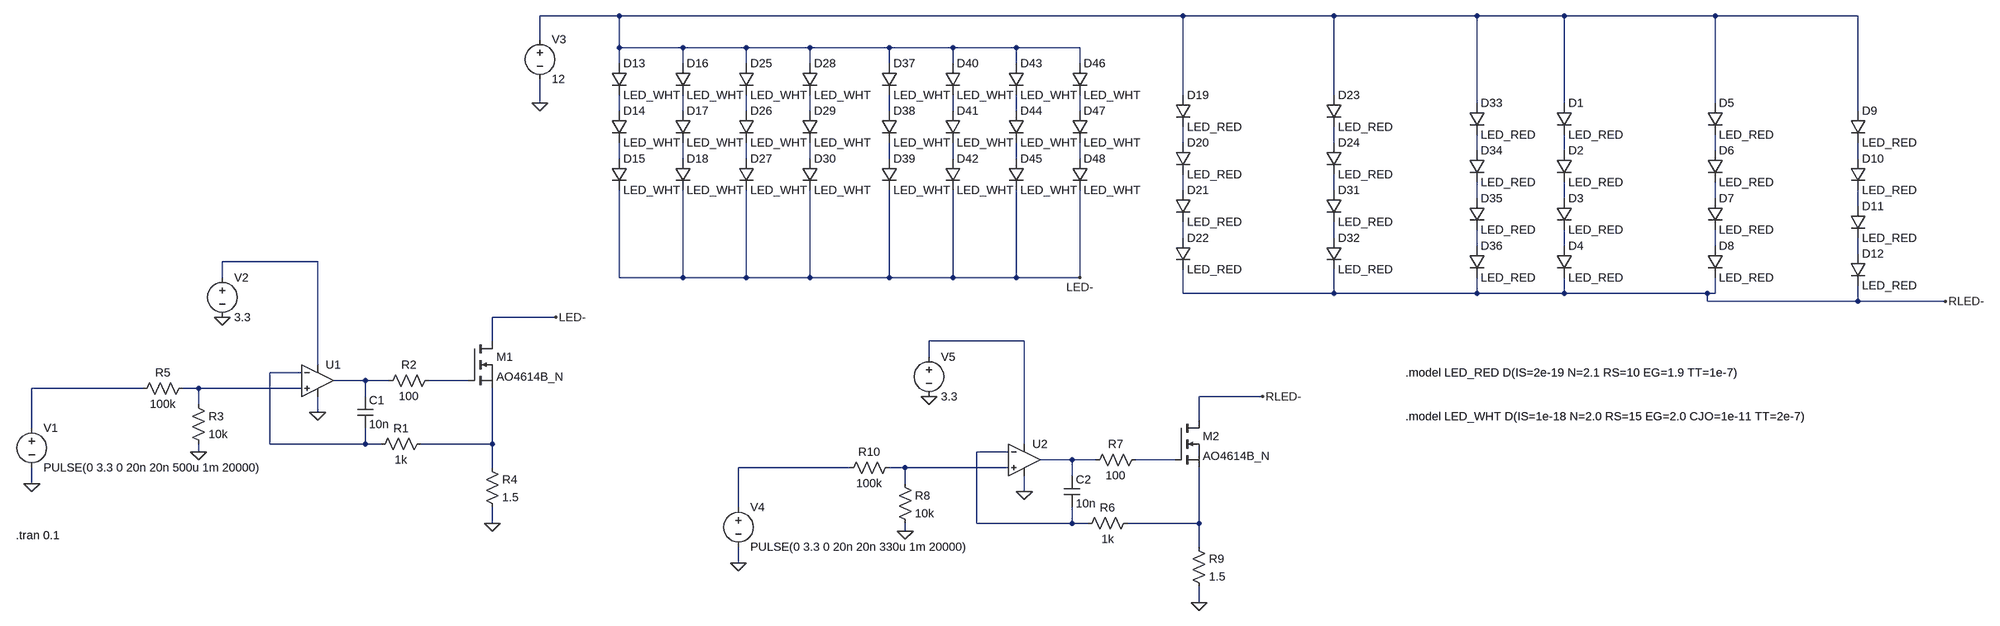
[diagram p0: schematic LED Driver Circuit.asc]
LED Driver Circuit.asc, the LTspice schematic file:
Version 4
SHEET 1 3560 976
WIRE 800 -576 640 -576
WIRE 1936 -576 800 -576
WIRE 2240 -576 1936 -576
WIRE 2528 -576 2240 -576
WIRE 2704 -576 2528 -576
WIRE 3008 -576 2704 -576
WIRE 3296 -576 3008 -576
WIRE 640 -528 640 -576
WIRE 800 -512 800 -576
WIRE 928 -512 800 -512
WIRE 1056 -512 928 -512
WIRE 1184 -512 1056 -512
WIRE 1344 -512 1184 -512
WIRE 1472 -512 1344 -512
WIRE 1600 -512 1472 -512
WIRE 1728 -512 1600 -512
WIRE 800 -480 800 -512
WIRE 928 -480 928 -512
WIRE 1056 -480 1056 -512
WIRE 1184 -480 1184 -512
WIRE 1344 -480 1344 -512
WIRE 1472 -480 1472 -512
WIRE 1600 -480 1600 -512
WIRE 1728 -480 1728 -512
WIRE 1936 -416 1936 -576
WIRE 2240 -416 2240 -576
WIRE 640 -400 640 -448
WIRE 2528 -400 2528 -576
WIRE 2704 -400 2704 -576
WIRE 3008 -400 3008 -576
WIRE 800 -384 800 -416
WIRE 928 -384 928 -416
WIRE 1056 -384 1056 -416
WIRE 1184 -384 1184 -416
WIRE 1344 -384 1344 -416
WIRE 1472 -384 1472 -416
WIRE 1600 -384 1600 -416
WIRE 1728 -384 1728 -416
WIRE 3296 -384 3296 -576
WIRE 1936 -320 1936 -352
WIRE 2240 -320 2240 -352
WIRE 2528 -304 2528 -336
WIRE 2704 -304 2704 -336
WIRE 3008 -304 3008 -336
WIRE 800 -288 800 -320
WIRE 928 -288 928 -320
WIRE 1056 -288 1056 -320
WIRE 1184 -288 1184 -320
WIRE 1344 -288 1344 -320
WIRE 1472 -288 1472 -320
WIRE 1600 -288 1600 -320
WIRE 1728 -288 1728 -320
WIRE 3296 -288 3296 -320
WIRE 1936 -224 1936 -256
WIRE 2240 -224 2240 -256
WIRE 2528 -208 2528 -240
WIRE 2704 -208 2704 -240
WIRE 3008 -208 3008 -240
WIRE 3296 -192 3296 -224
WIRE 1936 -128 1936 -160
WIRE 2240 -128 2240 -160
WIRE 2528 -112 2528 -144
WIRE 2704 -112 2704 -144
WIRE 3008 -112 3008 -144
WIRE 3296 -96 3296 -128
WIRE 192 -80 0 -80
WIRE 0 -48 0 -80
WIRE 800 -48 800 -224
WIRE 928 -48 928 -224
WIRE 928 -48 800 -48
WIRE 1056 -48 1056 -224
WIRE 1056 -48 928 -48
WIRE 1184 -48 1184 -224
WIRE 1184 -48 1056 -48
WIRE 1344 -48 1344 -224
WIRE 1344 -48 1184 -48
WIRE 1472 -48 1472 -224
WIRE 1472 -48 1344 -48
WIRE 1600 -48 1600 -224
WIRE 1600 -48 1472 -48
WIRE 1728 -48 1728 -224
WIRE 1728 -48 1600 -48
WIRE 1936 -16 1936 -64
WIRE 2240 -16 2240 -64
WIRE 2240 -16 1936 -16
WIRE 2528 -16 2528 -48
WIRE 2528 -16 2240 -16
WIRE 2704 -16 2704 -48
WIRE 2704 -16 2528 -16
WIRE 2992 -16 2704 -16
WIRE 3008 -16 3008 -48
WIRE 3008 -16 2992 -16
WIRE 2992 0 2992 -16
WIRE 3296 0 3296 -32
WIRE 3296 0 2992 0
WIRE 3472 0 3296 0
WIRE 672 32 544 32
WIRE 544 80 544 32
WIRE 1616 80 1424 80
WIRE 1424 112 1424 80
WIRE 192 128 192 -80
WIRE 160 144 96 144
WIRE 288 160 224 160
WIRE 336 160 288 160
WIRE 496 160 416 160
WIRE -160 176 -384 176
WIRE -48 176 -80 176
WIRE 160 176 -48 176
WIRE 288 192 288 160
WIRE 2096 192 1968 192
WIRE -48 208 -48 176
WIRE 192 224 192 192
WIRE 1968 240 1968 192
WIRE -384 256 -384 176
WIRE 96 288 96 144
WIRE 288 288 288 256
WIRE 288 288 96 288
WIRE 320 288 288 288
WIRE 544 288 544 176
WIRE 544 288 400 288
WIRE 1616 288 1616 80
WIRE -48 304 -48 288
WIRE 1584 304 1520 304
WIRE 1712 320 1648 320
WIRE 1760 320 1712 320
WIRE 1920 320 1840 320
WIRE 544 336 544 288
WIRE 1264 336 1040 336
WIRE 1376 336 1344 336
WIRE 1584 336 1376 336
WIRE 1712 352 1712 320
WIRE -384 368 -384 336
WIRE 1376 368 1376 336
WIRE 1616 384 1616 352
WIRE 1040 416 1040 336
WIRE 544 448 544 416
WIRE 1520 448 1520 304
WIRE 1712 448 1712 416
WIRE 1712 448 1520 448
WIRE 1744 448 1712 448
WIRE 1968 448 1968 336
WIRE 1968 448 1824 448
WIRE 1376 464 1376 448
WIRE 1968 496 1968 448
WIRE 1040 528 1040 496
WIRE 1968 608 1968 576
FLAG 192 224 0
FLAG 0 32 0
FLAG -384 368 0
FLAG -48 304 0
FLAG 544 448 0
FLAG 672 32 LED-
FLAG 1728 -48 LED-
FLAG 640 -400 0
FLAG 1616 384 0
FLAG 1424 192 0
FLAG 1040 528 0
FLAG 1376 464 0
FLAG 1968 608 0
FLAG 2096 192 RLED-
FLAG 3472 0 RLED-
SYMBOL OpAmps\\UniversalOpAmp2 192 160 R0
SYMATTR InstName U1
SYMATTR Value2 Avol=1Meg GBW=5.5Meg Slew=2Meg
SYMATTR SpiceLine Ilimit=50m Rail=0 Vos=0
SYMBOL res 416 272 R90
WINDOW 0 0 56 VBottom 2
WINDOW 3 32 56 VTop 2
SYMATTR InstName R1
SYMATTR Value 1k
SYMBOL cap 272 192 R0
SYMATTR InstName C1
SYMATTR Value 10n
SYMBOL res 432 144 R90
WINDOW 0 0 56 VBottom 2
WINDOW 3 32 56 VTop 2
SYMATTR InstName R2
SYMATTR Value 100
SYMBOL voltage -384 240 R0
WINDOW 123 0 0 Left 0
WINDOW 39 0 0 Left 0
SYMATTR InstName V1
SYMATTR Value PULSE(0 3.3 0 20n 20n 500u 1m 20000)
SYMBOL voltage 0 -64 R0
WINDOW 123 0 0 Left 0
WINDOW 39 0 0 Left 0
SYMATTR InstName V2
SYMATTR Value 3.3
SYMBOL res -64 192 R0
SYMATTR InstName R3
SYMATTR Value 10k
SYMBOL res 528 320 R0
SYMATTR InstName R4
SYMATTR Value 1.5
SYMBOL nmos 496 80 R0
SYMATTR InstName M1
SYMATTR Value AO4614B_N
SYMBOL voltage 640 -544 R0
WINDOW 123 0 0 Left 0
WINDOW 39 0 0 Left 0
SYMATTR InstName V3
SYMATTR Value 12
SYMBOL res -64 160 R90
WINDOW 0 0 56 VBottom 2
WINDOW 3 32 56 VTop 2
SYMATTR InstName R5
SYMATTR Value 100k
SYMBOL OpAmps\\UniversalOpAmp2 1616 320 R0
SYMATTR InstName U2
SYMATTR Value2 Avol=1Meg GBW=5.5Meg Slew=2Meg
SYMATTR SpiceLine Ilimit=50m Rail=0 Vos=0
SYMBOL res 1840 432 R90
WINDOW 0 0 56 VBottom 2
WINDOW 3 32 56 VTop 2
SYMATTR InstName R6
SYMATTR Value 1k
SYMBOL cap 1696 352 R0
SYMATTR InstName C2
SYMATTR Value 10n
SYMBOL res 1856 304 R90
WINDOW 0 0 56 VBottom 2
WINDOW 3 32 56 VTop 2
SYMATTR InstName R7
SYMATTR Value 100
SYMBOL voltage 1040 400 R0
WINDOW 123 0 0 Left 0
WINDOW 39 0 0 Left 0
SYMATTR InstName V4
SYMATTR Value PULSE(0 3.3 0 20n 20n 330u 1m 20000)
SYMBOL voltage 1424 96 R0
WINDOW 123 0 0 Left 0
WINDOW 39 0 0 Left 0
SYMATTR InstName V5
SYMATTR Value 3.3
SYMBOL res 1360 352 R0
SYMATTR InstName R8
SYMATTR Value 10k
SYMBOL res 1952 480 R0
SYMATTR InstName R9
SYMATTR Value 1.5
SYMBOL nmos 1920 240 R0
SYMATTR InstName M2
SYMATTR Value AO4614B_N
SYMBOL res 1360 320 R90
WINDOW 0 0 56 VBottom 2
WINDOW 3 32 56 VTop 2
SYMATTR InstName R10
SYMATTR Value 100k
SYMBOL diode 1920 -416 R0
SYMATTR InstName D19
SYMATTR Value LED_RED
SYMBOL diode 1920 -320 R0
SYMATTR InstName D20
SYMATTR Value LED_RED
SYMBOL diode 1920 -224 R0
SYMATTR InstName D21
SYMATTR Value LED_RED
SYMBOL diode 1920 -128 R0
SYMATTR InstName D22
SYMATTR Value LED_RED
SYMBOL diode 2224 -416 R0
SYMATTR InstName D23
SYMATTR Value LED_RED
SYMBOL diode 2224 -320 R0
SYMATTR InstName D24
SYMATTR Value LED_RED
SYMBOL diode 2224 -224 R0
SYMATTR InstName D31
SYMATTR Value LED_RED
SYMBOL diode 2224 -128 R0
SYMATTR InstName D32
SYMATTR Value LED_RED
SYMBOL diode 2512 -400 R0
SYMATTR InstName D33
SYMATTR Value LED_RED
SYMBOL diode 2512 -304 R0
SYMATTR InstName D34
SYMATTR Value LED_RED
SYMBOL diode 2512 -208 R0
SYMATTR InstName D35
SYMATTR Value LED_RED
SYMBOL diode 2512 -112 R0
SYMATTR InstName D36
SYMATTR Value LED_RED
SYMBOL diode 2688 -400 R0
SYMATTR InstName D1
SYMATTR Value LED_RED
SYMBOL diode 2688 -304 R0
SYMATTR InstName D2
SYMATTR Value LED_RED
SYMBOL diode 2688 -208 R0
SYMATTR InstName D3
SYMATTR Value LED_RED
SYMBOL diode 2688 -112 R0
SYMATTR InstName D4
SYMATTR Value LED_RED
SYMBOL diode 2992 -400 R0
SYMATTR InstName D5
SYMATTR Value LED_RED
SYMBOL diode 2992 -304 R0
SYMATTR InstName D6
SYMATTR Value LED_RED
SYMBOL diode 2992 -208 R0
SYMATTR InstName D7
SYMATTR Value LED_RED
SYMBOL diode 2992 -112 R0
SYMATTR InstName D8
SYMATTR Value LED_RED
SYMBOL diode 3280 -384 R0
SYMATTR InstName D9
SYMATTR Value LED_RED
SYMBOL diode 3280 -288 R0
SYMATTR InstName D10
SYMATTR Value LED_RED
SYMBOL diode 3280 -192 R0
SYMATTR InstName D11
SYMATTR Value LED_RED
SYMBOL diode 3280 -96 R0
SYMATTR InstName D12
SYMATTR Value LED_RED
SYMBOL diode 784 -480 R0
SYMATTR InstName D13
SYMATTR Value LED_WHT
SYMBOL diode 784 -384 R0
SYMATTR InstName D14
SYMATTR Value LED_WHT
SYMBOL diode 784 -288 R0
SYMATTR InstName D15
SYMATTR Value LED_WHT
SYMBOL diode 912 -480 R0
SYMATTR InstName D16
SYMATTR Value LED_WHT
SYMBOL diode 912 -384 R0
SYMATTR InstName D17
SYMATTR Value LED_WHT
SYMBOL diode 912 -288 R0
SYMATTR InstName D18
SYMATTR Value LED_WHT
SYMBOL diode 1040 -480 R0
SYMATTR InstName D25
SYMATTR Value LED_WHT
SYMBOL diode 1040 -384 R0
SYMATTR InstName D26
SYMATTR Value LED_WHT
SYMBOL diode 1040 -288 R0
SYMATTR InstName D27
SYMATTR Value LED_WHT
SYMBOL diode 1168 -480 R0
SYMATTR InstName D28
SYMATTR Value LED_WHT
SYMBOL diode 1168 -384 R0
SYMATTR InstName D29
SYMATTR Value LED_WHT
SYMBOL diode 1168 -288 R0
SYMATTR InstName D30
SYMATTR Value LED_WHT
SYMBOL diode 1328 -480 R0
SYMATTR InstName D37
SYMATTR Value LED_WHT
SYMBOL diode 1328 -384 R0
SYMATTR InstName D38
SYMATTR Value LED_WHT
SYMBOL diode 1328 -288 R0
SYMATTR InstName D39
SYMATTR Value LED_WHT
SYMBOL diode 1456 -480 R0
SYMATTR InstName D40
SYMATTR Value LED_WHT
SYMBOL diode 1456 -384 R0
SYMATTR InstName D41
SYMATTR Value LED_WHT
SYMBOL diode 1456 -288 R0
SYMATTR InstName D42
SYMATTR Value LED_WHT
SYMBOL diode 1584 -480 R0
SYMATTR InstName D43
SYMATTR Value LED_WHT
SYMBOL diode 1584 -384 R0
SYMATTR InstName D44
SYMATTR Value LED_WHT
SYMBOL diode 1584 -288 R0
SYMATTR InstName D45
SYMATTR Value LED_WHT
SYMBOL diode 1712 -480 R0
SYMATTR InstName D46
SYMATTR Value LED_WHT
SYMBOL diode 1712 -384 R0
SYMATTR InstName D47
SYMATTR Value LED_WHT
SYMBOL diode 1712 -288 R0
SYMATTR InstName D48
SYMATTR Value LED_WHT
TEXT -416 472 Left 2 !.tran 0.1
TEXT 2384 144 Left 2 !.model LED_RED D(IS=2e-19 N=2.1 RS=10 EG=1.9 TT=1e-7)
TEXT 2384 232 Left 2 !.model LED_WHT D(IS=1e-18 N=2.0 RS=15 EG=2.0 CJO=1e-11 TT=2e-7)

The netlist it stands for:
* LED Driver Circuit.asc
XU1 N042 N038 N036 0 N039 level2 Avol=1Meg GBW=5.5Meg Slew=2Meg Ilimit=50m Rail=0 Vos=0 En=0 Enk=0 In=0 Ink=0 Rin=500Meg  ; pins In+ In- V+ V- OUT
R1 N043 N038 1k
C1 N039 N038 10n
R2 N040 N039 100
V1 N041 0 PULSE(0 3.3 0 20n 20n 500u 1m 20000)
V2 N036 0 3.3
R3 N042 0 10k
R4 N043 0 1.5
M1 LED- N040 N043 N043 AO4614B_N
V3 N001 0 12
R5 N042 N041 100k
XU2 N048 N044 N037 0 N045 level2 Avol=1Meg GBW=5.5Meg Slew=2Meg Ilimit=50m Rail=0 Vos=0 En=0 Enk=0 In=0 Ink=0 Rin=500Meg  ; pins In+ In- V+ V- OUT
R6 N049 N044 1k
C2 N045 N044 10n
R7 N046 N045 100
V4 N047 0 PULSE(0 3.3 0 20n 20n 330u 1m 20000)
V5 N037 0 3.3
R8 N048 0 10k
R9 N049 0 1.5
M2 RLED- N046 N049 N049 AO4614B_N
R10 N048 N047 100k
D19 N001 N010 LED_RED
D20 N010 N024 LED_RED
D21 N024 N030 LED_RED
D22 N030 RLED- LED_RED
D23 N001 N011 LED_RED
D24 N011 N025 LED_RED
D31 N025 N031 LED_RED
D32 N031 RLED- LED_RED
D33 N001 N012 LED_RED
D34 N012 N026 LED_RED
D35 N026 N032 LED_RED
D36 N032 RLED- LED_RED
D1 N001 N013 LED_RED
D2 N013 N027 LED_RED
D3 N027 N033 LED_RED
D4 N033 RLED- LED_RED
D5 N001 N014 LED_RED
D6 N014 N028 LED_RED
D7 N028 N034 LED_RED
D8 N034 RLED- LED_RED
D9 N001 N023 LED_RED
D10 N023 N029 LED_RED
D11 N029 N035 LED_RED
D12 N035 RLED- LED_RED
D13 N001 N002 LED_WHT
D14 N002 N015 LED_WHT
D15 N015 LED- LED_WHT
D16 N001 N003 LED_WHT
D17 N003 N016 LED_WHT
D18 N016 LED- LED_WHT
D25 N001 N004 LED_WHT
D26 N004 N017 LED_WHT
D27 N017 LED- LED_WHT
D28 N001 N005 LED_WHT
D29 N005 N018 LED_WHT
D30 N018 LED- LED_WHT
D37 N001 N006 LED_WHT
D38 N006 N019 LED_WHT
D39 N019 LED- LED_WHT
D40 N001 N007 LED_WHT
D41 N007 N020 LED_WHT
D42 N020 LED- LED_WHT
D43 N001 N008 LED_WHT
D44 N008 N021 LED_WHT
D45 N021 LED- LED_WHT
D46 N001 N009 LED_WHT
D47 N009 N022 LED_WHT
D48 N022 LED- LED_WHT
.model D D
.lib standard.dio
.model NMOS NMOS
.model PMOS PMOS
.lib standard.mos
.tran 0.1
.model LED_RED D(IS=2e-19 N=2.1 RS=10 EG=1.9 TT=1e-7)
.model LED_WHT D(IS=1e-18 N=2.0 RS=15 EG=2.0 CJO=1e-11 TT=2e-7)
.lib UniversalOpAmp2.lib
.backanno
.end